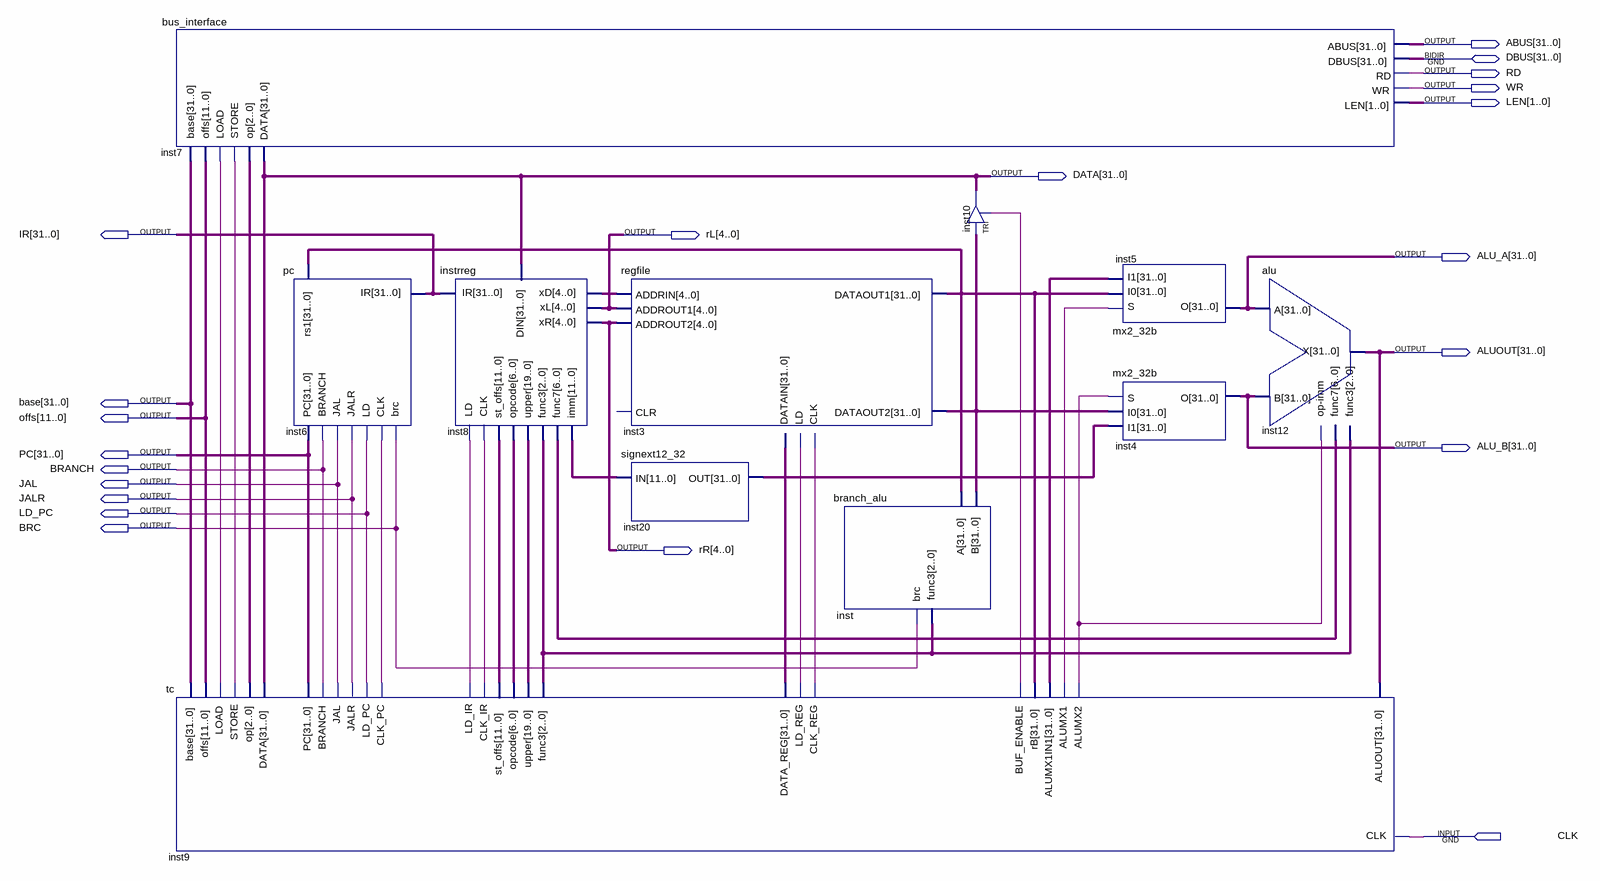
[diagram p0: schematic sheet]
// Quartus schematic rv32i_debug.bdf as structural Verilog: 11 symbols, 21 pins
module rv32i_debug (
  input  CLK,
  inout  [31:0] DBUS,
  output [31:0] ABUS,
  output RD,
  output WR,
  output [1:0] LEN,
  output [31:0] DATA,
  output [31:0] IR,
  output [4:0] rL,
  output [31:0] ALU_A,
  output [31:0] ALUOUT,
  output [31:0] base,
  output [11:0] offs,
  output [31:0] ALU_B,
  output [31:0] PC,
  output BRANCH,
  output JAL,
  output JALR,
  output LD_PC,
  output BRC,
  output [4:0] rR
);

  wire inst9_alumx1, inst9_alumx2, inst9_buf_enable, inst9_clk_ir, inst9_clk_pc, inst9_clk_reg, inst9_ld_ir,
       inst9_ld_reg, inst9_load, inst9_store;
  wire [2:0] inst8_func3, inst9_op;
  wire [4:0] inst8_xd;
  wire [6:0] inst8_func7, inst8_opcode;
  wire [11:0] inst8_imm, inst8_st_offs;
  wire [19:0] inst8_upper;
  wire [31:0] inst3_dataout1, inst3_dataout2, inst9_alumx1in1, inst9_data_reg, inst20_out;

  bus_interface inst7 (
    .base(base), .offs(offs), .LOAD(inst9_load), .STORE(inst9_store), .op(inst9_op), .ABUS(ABUS), .RD(RD),
    .WR(WR), .LEN(LEN), .DBUS(DBUS), .DATA(DATA));
  tc inst9 (
    .st_offs(inst8_st_offs), .func3(inst8_func3), .opcode(inst8_opcode), .CLK(CLK), .ALUOUT(ALUOUT),
    .upper(inst8_upper), .DATA(DATA), .PC(PC), .rB(inst3_dataout1), .op(inst9_op), .CLK_PC(inst9_clk_pc),
    .CLK_IR(inst9_clk_ir), .CLK_REG(inst9_clk_reg), .ALUMX1IN1(inst9_alumx1in1), .LD_PC(LD_PC),
    .LD_IR(inst9_ld_ir), .ALUMX1(inst9_alumx1), .LD_REG(inst9_ld_reg), .BRANCH(BRANCH),
    .DATA_REG(inst9_data_reg), .JAL(JAL), .ALUMX2(inst9_alumx2), .JALR(JALR), .LOAD(inst9_load),
    .STORE(inst9_store), .BUF_ENABLE(inst9_buf_enable), .base(base), .offs(offs));
  pc inst6 (
    .brc(BRC), .BRANCH(BRANCH), .JAL(JAL), .JALR(JALR), .IR(IR), .rs1(inst3_dataout1), .LD(LD_PC),
    .CLK(inst9_clk_pc), .PC(PC));
  instrreg inst8 (
    .DIN(DATA), .LD(inst9_ld_ir), .CLK(inst9_clk_ir), .IR(IR), .opcode(inst8_opcode), .func7(inst8_func7),
    .xR(rR), .xL(rL), .func3(inst8_func3), .xD(inst8_xd), .imm(inst8_imm), .upper(inst8_upper),
    .st_offs(inst8_st_offs));
  regfile inst3 (
    .LD(inst9_ld_reg), .ADDRIN(inst8_xd), .DATAIN(inst9_data_reg), .CLK(inst9_clk_reg), .ADDROUT1(rL),
    .ADDROUT2(rR), .DATAOUT2(inst3_dataout2), .DATAOUT1(inst3_dataout1));  // open: CLR
  signext12_32 inst20 (.IN(inst8_imm), .OUT(inst20_out));
  branch_alu inst (.A(inst3_dataout1), .B(inst3_dataout2), .func3(inst8_func3), .brc(BRC));
  TRI inst10[31:0] (.IN(inst3_dataout2), .OE(inst9_buf_enable), .OUT(DATA));
  mx2_32b inst5 (.S(inst9_alumx1), .I0(inst3_dataout1), .I1(inst9_alumx1in1), .O(ALU_A));
  mx2_32b inst4 (.S(inst9_alumx2), .I0(inst3_dataout2), .I1(inst20_out), .O(ALU_B));
  alu inst12 (.A(ALU_A), .B(ALU_B), .func3(inst8_func3), .\op-imm (inst9_alumx2), .func7(inst8_func7), .X(ALUOUT));
endmodule
